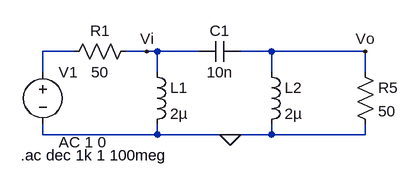
[diagram p0: schematic ej3.asc]
ej3.asc, the LTspice schematic file:
Version 4
SHEET 1 880 680
WIRE 48 64 0 64
WIRE 160 64 128 64
WIRE 176 64 160 64
WIRE 240 64 176 64
WIRE 352 64 304 64
WIRE 496 64 352 64
WIRE 0 96 0 64
WIRE 176 96 176 64
WIRE 352 96 352 64
WIRE 496 96 496 64
WIRE 0 192 0 176
WIRE 176 192 176 176
WIRE 176 192 0 192
WIRE 288 192 176 192
WIRE 352 192 352 176
WIRE 352 192 288 192
WIRE 496 192 496 176
WIRE 496 192 352 192
FLAG 496 64 Vo
FLAG 160 64 Vi
FLAG 288 192 0
SYMBOL voltage 0 80 R0
WINDOW 123 24 124 Left 2
WINDOW 39 0 0 Left 0
SYMATTR InstName V1
SYMATTR Value ""
SYMATTR Value2 AC 1 0
SYMBOL res 144 48 R90
WINDOW 0 0 56 VBottom 2
WINDOW 3 32 56 VTop 2
SYMATTR InstName R1
SYMATTR Value 50
SYMBOL res 480 80 R0
SYMATTR InstName R5
SYMATTR Value 50
SYMBOL ind 160 80 R0
SYMATTR InstName L1
SYMATTR Value 2µ
SYMBOL ind 336 80 R0
SYMATTR InstName L2
SYMATTR Value 2µ
SYMBOL cap 304 48 R90
WINDOW 0 0 32 VBottom 2
WINDOW 3 32 32 VTop 2
SYMATTR InstName C1
SYMATTR Value 10n
TEXT -34 224 Left 2 !.ac dec 1k 1 100meg

The netlist it stands for:
* ej3.asc
V1 N001 0 AC 1 0
R1 Vi N001 50
R5 Vo 0 50
L1 Vi 0 2µ
L2 Vo 0 2µ
C1 Vo Vi 10n
.ac dec 1k 1 100meg
.backanno
.end